# Altium schematic sheet zs-pentagon-dip_5.SchDoc
size A4
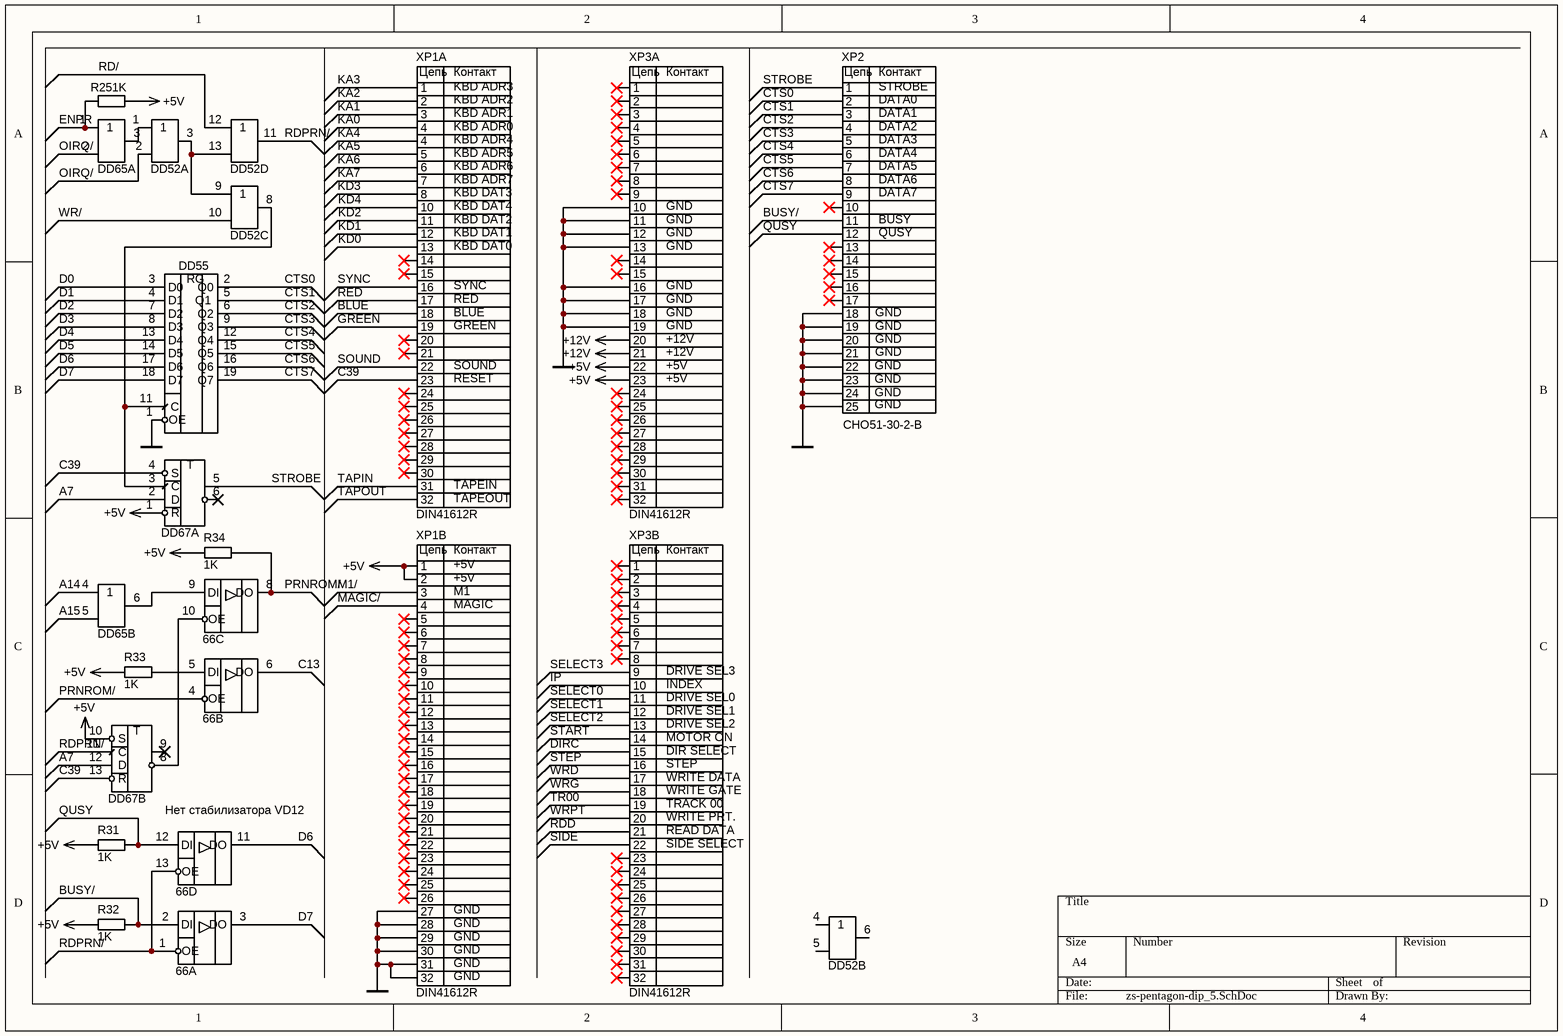
[diagram p0: zs-pentagon-dip_5.SchDoc]

## Parts
66  КР1533ЛП8  [DIP14]  (value not drawn)  (parts A,B,C,D of 4)
DD52  КР1533ЛЛ1  [DIP14]  (value not drawn)  (parts A,B,C,D of 4)
DD55  КР1533ИР23  [DIP20]  (value not drawn)
DD65  КР1533ЛЛ1  [DIP14]  (value not drawn)  (parts A,B of 4)
DD67  КР1533ТМ2  [DIP14]  (value not drawn)  (parts A,B of 2)
R25  1K  [R0603]
R31  1K  [R0603]
R32  1K  [R0603]
R33  1K  [R0603]
R34  1K  [R0603]
XP1  DIN41612R  [TE_6-1393644-3]  (parts A,B of 2)
XP2  СНО51-30-2-В
XP3  DIN41612R  [TE_6-1393644-3]  (parts A,B of 2)

## Nets
+5V: DD67.1(R) DD67.10(S) R25.1 R31.1 R32.1 R33.1 R34.1 XP1.33(1) XP1.34(2) XP3.22 XP3.23
+12V: XP3.20 XP3.21
GND: DD55.1(OE) XP1.59(27) XP1.60(28) XP1.61(29) XP1.62(30) XP1.63(31) XP1.64(32) XP2.18 XP2.19 XP2.20 XP2.21 XP2.22 XP2.23 XP2.24 XP2.25 XP3.10 XP3.11 XP3.12 XP3.13 XP3.16 XP3.17 XP3.18 XP3.19
A7: DD67.2(D) DD67.12(D)
A14: DD65.4
A15: DD65.5
BLUE: XP1.18
BUSY/: 66.2(DI) R32.2 XP2.11
C13: 66.6(DO)
C39: DD67.4(S) DD67.13(R) XP1.23
CTS0: DD55.2(Q0) XP2.2
CTS1: DD55.5(Q1) XP2.3
CTS2: DD55.6(Q2) XP2.4
CTS3: DD55.9(Q3) XP2.5
CTS4: DD55.12(Q4) XP2.6
CTS5: DD55.15(Q5) XP2.7
CTS6: DD55.16(Q6) XP2.8
CTS7: DD55.19(Q7) XP2.9
D0: DD55.3(D0)
D1: DD55.4(D1)
D2: DD55.7(D2)
D3: DD55.8(D3)
D4: DD55.13(D4)
D5: DD55.14(D5)
D6: 66.11(DO) DD55.17(D6)
D7: 66.3(DO) DD55.18(D7)
DIRC: XP3.47(15)
ENPR: DD65.1 R25.2
GREEN: XP1.19
IP: XP3.42(10)
KA0: XP1.4
KA1: XP1.3
KA2: XP1.2
KA3: XP1.1
KA4: XP1.5(4)
KA5: XP1.6(5)
KA6: XP1.7(6)
KA7: XP1.8(7)
KD0: XP1.13
KD1: XP1.12
KD2: XP1.11
KD3: XP1.9(8)
KD4: XP1.10
M1/: XP1.35(3)
MAGIC/: XP1.36(4)
OIRQ/: DD52.2 DD65.2
PRNROM/: 66.4(OE) 66.8(DO) R34.2
QUSY: 66.12(DI) R31.2 XP2.12
RD/: DD52.12
RDD: XP3.53(21)
RDPRN/: 66.1(OE) 66.13(OE) DD52.11 DD67.11(C)
RED: XP1.17
SELECT0: XP3.43(11)
SELECT1: XP3.44(12)
SELECT2: XP3.45(13)
SELECT3: XP3.41(9)
SIDE: XP3.54(22)
SOUND: XP1.22
START: XP3.46(14)
STEP: XP3.48(16)
STROBE: DD67.5 XP2.1
SYNC: XP1.16
TAPIN: XP1.31
TAPOUT: XP1.32
TR00: XP3.51(19)
WR/: DD52.10
WRD: XP3.49(17)
WRG: XP3.50(18)
WRPT: XP3.52(20)
Net66_5: 66.5(DI) R33.2
Net66_9: 66.9(DI) DD65.6
Net66_10: 66.10(OE) DD67.8
NetDD52_1: DD52.1 DD65.3
NetDD52_3: DD52.3 DD52.9 DD52.13
NetDD52_8: DD52.8 DD55.11(C) DD67.3(C)

Not connected (* = marked no-connect by the designer): 66 7(GND) 14(VCC); DD52 4 5 6 7(GND) 14(VCC); DD55 10(GND) 20(VCC); DD65 7(GND) 14(VCC); DD67 6* 7(GND) 9* 14(VCC); XP1 14* 15* 20* 21* 24* 25* 26* 27* 28* 29* 30* 37(5)* 38(6)* 39(7)* 40(8)* 41(9)* 42(10)* 43(11)* 44(12)* 45(13)* 46(14)* 47(15)* 48(16)* 49(17)* 50(18)* 51(19)* 52(20)* 53(21)* 54(22)* 55(23)* 56(24)* 57(25)* 58(26)*; XP2 10* 13* 14* 15* 16* 17*; XP3 1* 2* 3* 4* 5* 6* 7* 8* 9* 14* 15* 24* 25* 26* 27* 28* 29* 30* 31* 32* 33(1)* 34(2)* 35(3)* 36(4)* 37(5)* 38(6)* 39(7)* 40(8)* 55(23)* 56(24)* 57(25)* 58(26)* 59(27)* 60(28)* 61(29)* 62(30)* 63(31)* 64(32)*

## Notes on the sheet
- Нет стабилизатора VD12
- (in symbol DIN41612R Pent, part A) Цепь; Контакт; KBD ADR3; KBD ADR2; KBD ADR1; KBD ADR0; KBD ADR4; KBD ADR5; KBD ADR6; KBD ADR7; KBD DAT3; KBD DAT4; KBD DAT2; KBD DAT1; KBD DAT0; SYNC; RED; BLUE; GREEN; SOUND; RESET; TAPEIN; TAPEOUT
- (in symbol DIN41612R Pent, part B) Цепь; Контакт; +5V; M1; MAGIC; GND
- (in symbol DIN41612R Pent XP2, part A) Цепь; Контакт; GND; +12V; +5V
- (in symbol DIN41612R Pent XP2, part B) Цепь; Контакт; DRIVE SEL3; INDEX; DRIVE SEL0; DRIVE SEL1; DRIVE SEL2; MOTOR ON; DIR SELECT; STEP; WRITE DATA; WRITE GATE; TRACK 00; WRITE PRT.; READ DATA; SIDE SELECT
- (in symbol КР1533ИР23) RG
- (in symbol КР1533ТМ2, part A) Т
- (in symbol КР1533ТМ2, part B) Т
- (in symbol СНО51-30-2-В) Цепь; Контакт; STROBE; DATA0; DATA1; DATA2; DATA3; DATA4; DATA5; DATA6; DATA7; BUSY; QUSY; GND

## Library data of the parts
R25 R31-R34 = Res
XP1 = DIN41612R Pent: zx-pentagon XP1
XP3 = DIN41612R Pent XP2: zx-pentagon XP2